# Altium schematic sheet 03_power.SchDoc
size B
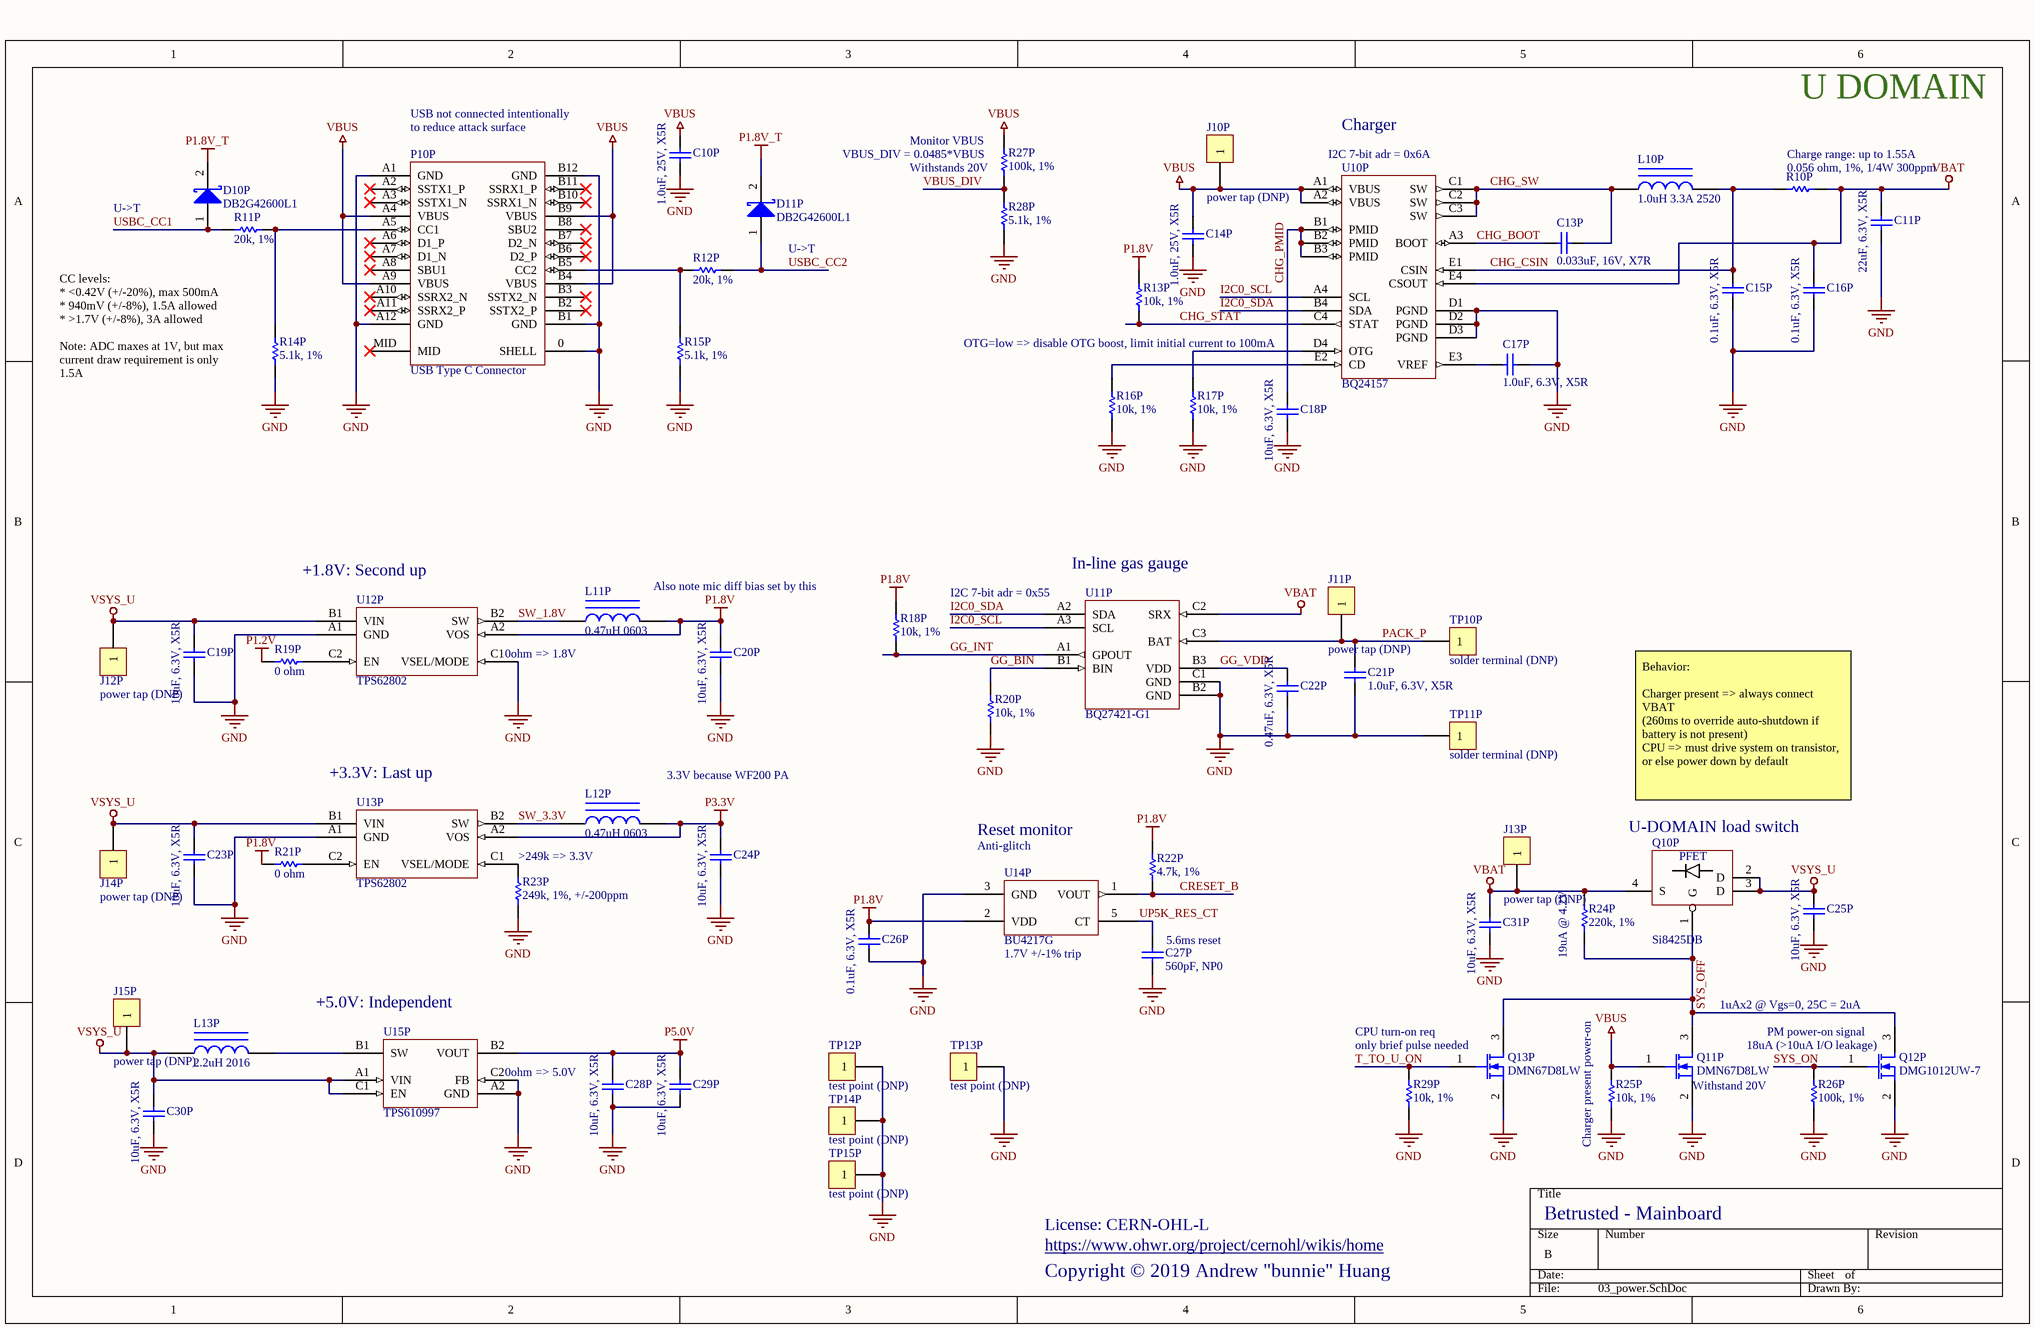
[diagram p0: 03_power.SchDoc]

## Parts
C10P  1.0uF, 25V, X5R  [B_CAP0603]
C11P  22uF, 6.3V, X5R  [B_CAP0805]
C13P  0.033uF, 16V, X7R  [B_RES0402]
C14P  1.0uF, 25V, X5R  [B_CAP0603]
C15P  0.1uF, 6.3V, X5R  [B_CAP0201]
C16P  0.1uF, 6.3V, X5R  [B_CAP0201]
C17P  1.0uF, 6.3V, X5R  [B_CAP0201]
C18P  10uF, 6.3V, X5R  [B_CAP0603]
C19P  10uF, 6.3V, X5R  [B_CAP0603]
C20P  10uF, 6.3V, X5R  [B_CAP0603]
C21P  1.0uF, 6.3V, X5R  [B_CAP0201]
C22P  0.47uF, 6.3V, X5R  [B_CAP0201]
C23P  10uF, 6.3V, X5R  [B_CAP0603]
C24P  10uF, 6.3V, X5R  [B_CAP0603]
C25P  10uF, 6.3V, X5R  [B_CAP0603]
C26P  0.1uF, 6.3V, X5R  [B_CAP0201]
C27P  560pF, NP0  [B_RES0201]
C28P  10uF, 6.3V, X5R  [B_CAP0603]
C29P  10uF, 6.3V, X5R  [B_CAP0603]
C30P  10uF, 6.3V, X5R  [B_CAP0603]
C31P  10uF, 6.3V, X5R  [B_CAP0603]
D10P  DB2G42600L1  [B_DIO0402]
D11P  DB2G42600L1  [B_DIO0402]
J10P  power tap (DNP)  [RESTAP-0603]
J11P  power tap (DNP)  [RESTAP-0603]
J12P  power tap (DNP)  [RESTAP-0603]
J13P  power tap (DNP)  [RESTAP-0603]
J14P  power tap (DNP)  [RESTAP-0603]
J15P  power tap (DNP)  [RESTAP-0603]
L10P  1.0uH 3.3A 2520  [B_IND2025_SAM]
L11P  0.47uH 0603  [B_IND0603]
L12P  0.47uH 0603  [B_IND0603]
L13P  2.2uH 2016  [B_IND2016_TDK]
P10P  USB Type C Connector  [HIROSE_CX90B1-24P]
Q10P  Si8425DB  [VISHAY_MICRO_FOOT_4_BUMP]
Q11P  DMN67D8LW  [SOT323-3AN]
Q12P  DMG1012UW-7  [SOT323-3AN]
Q13P  DMN67D8LW  [SOT323-3AN]
R10P  0.056 ohm, 1%, 1/4W 300ppm  [B_RES0402]
R11P  20k, 1%  [B_RES0201]
R12P  20k, 1%  [B_RES0201]
R13P  10k, 1%  [B_RES0201]
R14P  5.1k, 1%  [B_RES0201]
R15P  5.1k, 1%  [B_RES0201]
R16P  10k, 1%  [B_RES0201]
R17P  10k, 1%  [B_RES0201]
R18P  10k, 1%  [B_RES0201]
R19P  0 ohm  [B_RES0201]
R20P  10k, 1%  [B_RES0201]
R21P  0 ohm  [B_RES0201]
R22P  4.7k, 1%  [B_RES0201]
R23P  249k, 1%, +/-200ppm  [B_RES0402]
R24P  220k, 1%  [B_RES0201]
R25P  10k, 1%  [B_RES0201]
R26P  100k, 1%  [B_RES0201]
R27P  100k, 1%  [B_RES0201]
R28P  5.1k, 1%  [B_RES0201]
R29P  10k, 1%  [B_RES0201]
TP10P  solder terminal (DNP)  [55-MIL-HOLE]
TP11P  solder terminal (DNP)  [55-MIL-HOLE]
TP12P  test point (DNP)  [TP_2MM_SQ]
TP13P  test point (DNP)  [TP_2MM_SQ]
TP14P  test point (DNP)  [TP_2MM_SQ]
TP15P  test point (DNP)  [TP_2MM_SQ]
U10P  BQ24157  [BGA20C40P4X5_200X214X62]
U11P  BQ27421-G1  [BGA9C50P3X3_162X158X62]
U12P  TPS62802  [BGA6C35P2X3_70X105X40_NSMD]
U13P  TPS62802  [BGA6C35P2X3_70X105X40_NSMD]
U14P  BU4217G  [SOT23-5AN]
U15P  TPS610997  [BGA6C40P2X3_88X123X62]

## Nets
GND: C10P.2 C11P.2 C14P.2 C15P.2 C16P.2 C17P.2 C18P.2 C19P.2 C20P.2 C21P.1 C22P.2 C23P.2 C24P.2 C25P.2 C26P.2 C27P.2 C28P.2 C29P.2 C30P.2 C31P.2 P10P.0(SHELL) P10P.A1(GND) P10P.A12(GND) P10P.B1(GND) P10P.B12(GND) Q11P.2(S) Q12P.2(S) Q13P.2(S) R14P.2 R15P.2 R16P.2 R17P.2 R20P.2 R23P.2 R25P.2 R26P.1 R28P.2 R29P.2 TP11P.1 TP12P.1 TP13P.1 TP14P.1 TP15P.1 U10P.D1(PGND) U10P.D2(PGND) U10P.D3(PGND) U11P.B2(GND) U11P.C1(GND) U12P.A1(GND) U12P.C1(VSEL/MODE) U13P.A1(GND) U14P.3(GND) U15P.A2(GND) U15P.C2(FB)
P1.2V: R19P.1
P1.8V: C20P.1 C26P.1 L11P.2 R13P.1 R18P.1 R21P.1 R22P.2 U12P.A2(VOS) U14P.2(VDD)
P1.8V_T: D10P.2(K) D11P.2(K)
P3.3V: C24P.1 L12P.2 U13P.A2(VOS)
P5.0V: C28P.1 C29P.1 U15P.B2(VOUT)
VBAT: C11P.1 C16P.1 C31P.1 J13P.1 Q10P.4(S) R10P.1 R24P.2 U10P.E4(CSOUT) U11P.C2(SRX)
VBUS: C10P.1 C14P.1 J10P.1 P10P.A4(VBUS) P10P.A9(VBUS) P10P.B4(VBUS) P10P.B9(VBUS) Q11P.1(G) R25P.1 R27P.2 U10P.A1(VBUS) U10P.A2(VBUS)
VSYS_U: C19P.1 C23P.1 C25P.1 C30P.1 J12P.1 J14P.1 J15P.1 L13P.1 Q10P.2(D) Q10P.3(D) U12P.B1(VIN) U13P.B1(VIN) U15P.A1(VIN) U15P.C1(EN)
CHG_BOOT: C13P.2 U10P.A3(BOOT)
CHG_CSIN: C15P.1 L10P.2 R10P.2 U10P.E1(CSIN)
CHG_PMID: C18P.1 U10P.B1(PMID) U10P.B2(PMID) U10P.B3(PMID)
CHG_STAT: R13P.2 U10P.C4(STAT)
CHG_SW: C13P.1 L10P.1 U10P.C1(SW) U10P.C2(SW) U10P.C3(SW)
CRESET_B: R22P.1 U14P.1(VOUT)
GG_BIN: R20P.1 U11P.B1(BIN)
GG_INT: R18P.2 U11P.A1(GPOUT)
GG_VDD: C22P.1 U11P.B3(VDD)
I2C0_SCL: U10P.A4(SCL) U11P.A3(SCL)
I2C0_SDA: U10P.B4(SDA) U11P.A2(SDA)
PACK_P: C21P.2 J11P.1 TP10P.1 U11P.C3(BAT)
SW_1.8V: L11P.1 U12P.B2(SW)
SW_3.3V: L12P.1 U13P.B2(SW)
SYS_OFF: Q10P.1(G) Q11P.3(D) Q12P.3(D) Q13P.3(D) R24P.1
SYS_ON: Q12P.1(G) R26P.2
T_TO_U_ON: Q13P.1(G) R29P.1
UP5K_RES_CT: C27P.1 U14P.5(CT)
USBC_CC1: D10P.1(A) R11P.2
USBC_CC2: D11P.1(A) R12P.1
VBUS_DIV: R27P.1 R28P.1
NetC17P_1: C17P.1 U10P.E3(VREF)
NetL13P_2: L13P.2 U15P.B1(SW)
NetP10P_A5: P10P.A5(CC1) R11P.1 R14P.1
NetP10P_B5: P10P.B5(CC2) R12P.2 R15P.1
NetR16P_1: R16P.1 U10P.E2(CD)
NetR17P_1: R17P.1 U10P.D4(OTG)
NetR19P_2: R19P.2 U12P.C2(EN)
NetR21P_2: R21P.2 U13P.C2(EN)
NetR23P_1: R23P.1 U13P.C1(VSEL/MODE)

Not connected (* = marked no-connect by the designer): P10P A2(SSTX1_P)* A3(SSTX1_N)* A6(D1_P)* A7(D1_N)* A8(SBU1)* A10(SSRX2_N)* A11(SSRX2_P)* B2(SSTX2_P)* B3(SSTX2_N)* B6(D2_P)* B7(D2_N)* B8(SBU2)* B10(SSRX1_N)* B11(SSRX1_P)* MID*

## Notes on the sheet
- USB not connected intentionally
- (near P10P) to reduce attack surface
- Charger
- U DOMAIN
- (near R27P) VBUS_DIV = 0.0485*VBUS
- (near R27P) Monitor VBUS
- (near R27P) Withstands 20V
- (near U10P) I2C 7-bit adr = 0x6A
- (near R10P) Charge range: up to 1.55A
- U->T
- (near D11P) U->T
- CC levels:
  * <0.42V (+/-20%), max 500mA
  * 940mV (+/-8%), 1.5A allowed
  * >1.7V (+/-8%), 3A allowed
  Note: ADC maxes at 1V, but max current draw requirement is only 1.5A
- (near U10P) OTG=low => disable OTG boost, limit initial current to 100mA
- (near U12P) +1.8V: Second up
- Also note mic diff bias set by this
- (near U11P) I2C 7-bit adr = 0x55
- (near U11P) In-line gas gauge
- 0ohm => 1.8V
- (near U13P) +3.3V: Last up
- 3.3V because WF200 PA
- Behavior:
  Charger present => always connect VBAT
  (260ms to override auto-shutdown if battery is not present)
  CPU => must drive system on transistor, or else power down by default
- (near R23P) >249k => 3.3V
- Reset monitor
- (near U14P) Anti-glitch
- (near Q10P) U-DOMAIN load switch
- (near C27P) 5.6ms reset
- (near U15P) +5.0V: Independent
- (near U14P) 1.7V +/-1% trip
- (near R24P) 19uA @ 4.2V
- 1uAx2 @ Vgs=0, 25C = 2uA
- 0ohm => 5.0V
- CPU turn-on req
- (near Q13P) only brief pulse needed
- (near Q12P) 18uA (>10uA I/O leakage)
- (near Q12P) PM power-on signal
- (near R25P) Charger present power-on
- (near Q11P) Withstand 20V
- License: CERN-OHL-L
- Copyright © 2019 Andrew "bunnie" Huang
- https://www.ohwr.org/project/cernohl/wikis/home
- Betrusted - Mainboard
- (in symbol Si8425DB) PFET

## Library data of the parts
C10P C14P = Cap Semi: Capacitor (Semiconductor SIM Model); MPN: CL10A105KA8NNNC; VENDOR: Samsung; MYPN: C-105-25-X5R-0603
C11P = Cap Semi: Capacitor (Semiconductor SIM Model); MPN: CL21A226MQQNNNE; VENDOR: Samsung; MYPN: C-226-6.3-X5R-0805
C13P = Cap Semi: Capacitor (Semiconductor SIM Model); MPN: CL05B333KO5NNNC; VENDOR: Samsung; MYPN: C-333-16-X7R-0402
C15P C16P C26P = Cap Semi: Capacitor (Semiconductor SIM Model); MPN: CL03A104KQ3NNNC; VENDOR: Samsung; MYPN: C-104-6p3-X5R-0201
C17P C21P = Cap Semi: Capacitor (Semiconductor SIM Model); MPN: GRM033R60J105MEA2D; VENDOR: Murata; MYPN: C-105-6p3-X5R-0201
C18P C19P C20P C23P C24P C25P C28P C29P C30P C31P = Cap Semi: Capacitor (Semiconductor SIM Model); MPN: CL10A106MQ8NNNC; VENDOR: Samsung; MYPN: C-106-6.3-X5R-0603
C22P = Cap Semi: Capacitor (Semiconductor SIM Model); MPN: CL03A474KQ3NNNH; VENDOR: Samsung; MYPN: C-474-6p3-X5R-0201
C27P = Cap Semi: Capacitor (Semiconductor SIM Model); MPN: GRM0335C1E561JA01D; VENDOR: Murata; MYPN: C-561-25-NP0-0201
D10P D11P = Diode 11DQ03: Schottky Rectifier; MYPN: D-SCHOTTKY-0402-CSP; VENDOR: Panasonic; ComponentLink1Description: Manufacturer Link; ComponentLink1URL: http://www.irf.com/; ComponentLink2Description: Datasheet; ComponentLink2URL: http://www.irf.com/product-info/datasheets/data/11dq03.pdf; MPN: DB2G42600L1
J10P J11P J12P J13P J14P J15P = CON1: Connector; MYPN: J-TP-PWRTAP-0603; MPN: DNP; VENDOR: DNP
L10P = Inductor Iron: Magnetic-Core Inductor; MPN: CIGW252010GL1R0MNE; VENDOR: Samsung; MYPN: L-CIGW252010GL1R0MNE
L11P L12P = Inductor Iron: Magnetic-Core Inductor; MPN: TFM160808ALC-R47MTAA; VENDOR: TDK; MYPN: L-TFM160808ALC-R47MTAA
L13P = Inductor Iron: Magnetic-Core Inductor; MPN: VLS201610CX-2R2M-1; VENDOR: TDK; MYPN: L-VLS201610CX-2R2M-1
P10P = USB_TYPE_C: MPN: CX90B1-24P; VENDOR: Hirose; MYPN: P-CX90B1-24P
Q10P = Si8425DB: P-channel 20V 6.2A 27mOhm @ -2.5V; MPN: SI8457DB-T1-E1; VENDOR: Vishay Siliconix; MYPN: Q-Si8457
Q11P Q13P = MOSFET-N: N-Channel MOSFET; VENDOR: Diodes Inc; MYPN: Q-DMN67D8LW; Published: 8-Jun-2000; LatestRevisionDate: 17-Jul-2002; LatestRevisionNote: Re-released for DXP Platform.; PackageVersion: 1995/1996; PackageReference: E3; Publisher: Altium Limited; MPN: DMN67D8LW
Q12P = MOSFET-N: N-Channel MOSFET; VENDOR: Diodes Inc; MYPN: Q-DMG1012UW-7; Published: 8-Jun-2000; LatestRevisionDate: 17-Jul-2002; LatestRevisionNote: Re-released for DXP Platform.; PackageVersion: 1995/1996; PackageReference: E3; Publisher: Altium Limited; MPN: DMG1012UW-7
R10P = Res1: Resistor; MPN: ERJ-2BWFR056X; VENDOR: Panasonic; MYPN: R-0R56-1P-1_4W-0402
R11P R12P = Res1: Resistor; VENDOR: ANY; MYPN: R-203-1P-1_16W-0201; MPN: ANY
R13P R16P R17P R18P R20P R25P R29P = Res1: Resistor; VENDOR: ANY; MYPN: R-103-1P-1_16W-0201; MPN: ANY
R14P R15P R28P = Res1: Resistor; VENDOR: ANY; MYPN: R-512-1P-1_16W-0201; MPN: ANY
R19P R21P = Res1: Resistor; VENDOR: ANY; MYPN: R-0R0-1P-1_16W-0201; MPN: ANY
R22P = Res1: Resistor; VENDOR: ANY; MYPN: R-472-1P-1_16W-0201; MPN: ANY
R23P = Res1: Resistor; MPN: RC0402FR-07249KL; VENDOR: Yageo; MYPN: R-2493-1P-1_16W-0402
R24P = Res1: Resistor; VENDOR: ANY; MYPN: R-224-1P-1_16W-0201; MPN: ANY
R26P R27P = Res1: Resistor; VENDOR: ANY; MYPN: R-104-1P-1_16W-0201; MPN: ANY
TP10P TP11P TP12P TP13P TP14P TP15P = CON1: Connector; MYPN: Built into PCB; MPN: DNP; VENDOR: DNP
U10P = BQ24157: Fully integrated switch-mode charger with USB compliance and OTG support; MPN: BQ24157YFFR; VENDOR: TI; MYPN: U-BQ24157YFF(R/T)
U11P = BQ27421-G1: System-Side Impedance Track Fuel Gauge with integrated Sense Resistor; MPN: bq27421YZFT-G1A; VENDOR: TI; MYPN: bq27421YZF(T/R)-G1A
U12P U13P = TPS62802: Buck regulator, 4MHz, 0.6A, 1.8V-3.3V, low Iq; MPN: TPS62802YKAR; VENDOR: TI; MYPN: U-TPS62802YKA(T/R)
U14P = BU42XXG: Low voltage free delay time setting CMOS voltage detector IC; MPN: BU4217G-TR; MYPN: U-BU4217G-TR; VENDOR: Rohm
U15P = TPS610997: Synchronous Boost Converter with Ultra-Low Iq; MPN: TPS610997YFFR; VENDOR: TI; MYPN: TPS610997YFFT(T/R)